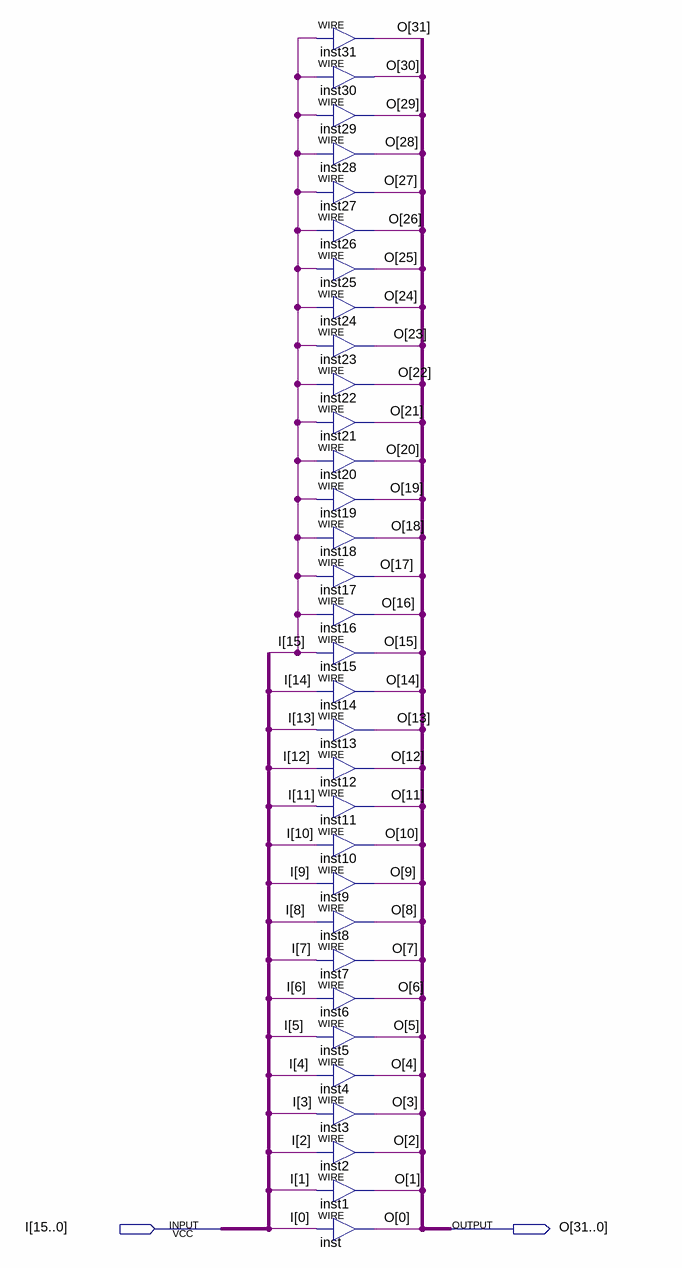
[diagram p0: schematic sheet]
// Quartus schematic SignExtend16to32.bdf as structural Verilog: 32 symbols, 2 pins
module SignExtend16to32 (
  input  [15:0] I,
  output [31:0] O
);

  assign O[31] = I[15];  // WIRE inst31
  assign O[30] = I[15];  // WIRE inst30
  assign O[29] = I[15];  // WIRE inst29
  assign O[28] = I[15];  // WIRE inst28
  assign O[27] = I[15];  // WIRE inst27
  assign O[26] = I[15];  // WIRE inst26
  assign O[25] = I[15];  // WIRE inst25
  assign O[24] = I[15];  // WIRE inst24
  assign O[23] = I[15];  // WIRE inst23
  assign O[22] = I[15];  // WIRE inst22
  assign O[21] = I[15];  // WIRE inst21
  assign O[20] = I[15];  // WIRE inst20
  assign O[19] = I[15];  // WIRE inst19
  assign O[18] = I[15];  // WIRE inst18
  assign O[17] = I[15];  // WIRE inst17
  assign O[16] = I[15];  // WIRE inst16
  assign O[15] = I[15];  // WIRE inst15
  assign O[14] = I[14];  // WIRE inst14
  assign O[13] = I[13];  // WIRE inst13
  assign O[12] = I[12];  // WIRE inst12
  assign O[11] = I[11];  // WIRE inst11
  assign O[10] = I[10];  // WIRE inst10
  assign O[9] = I[9];  // WIRE inst9
  assign O[8] = I[8];  // WIRE inst8
  assign O[7] = I[7];  // WIRE inst7
  assign O[6] = I[6];  // WIRE inst6
  assign O[5] = I[5];  // WIRE inst5
  assign O[4] = I[4];  // WIRE inst4
  assign O[3] = I[3];  // WIRE inst3
  assign O[2] = I[2];  // WIRE inst2
  assign O[1] = I[1];  // WIRE inst1
  assign O[0] = I[0];  // WIRE inst
endmodule
